# EAGLE schematic bms_master (EAGLE 6.2)
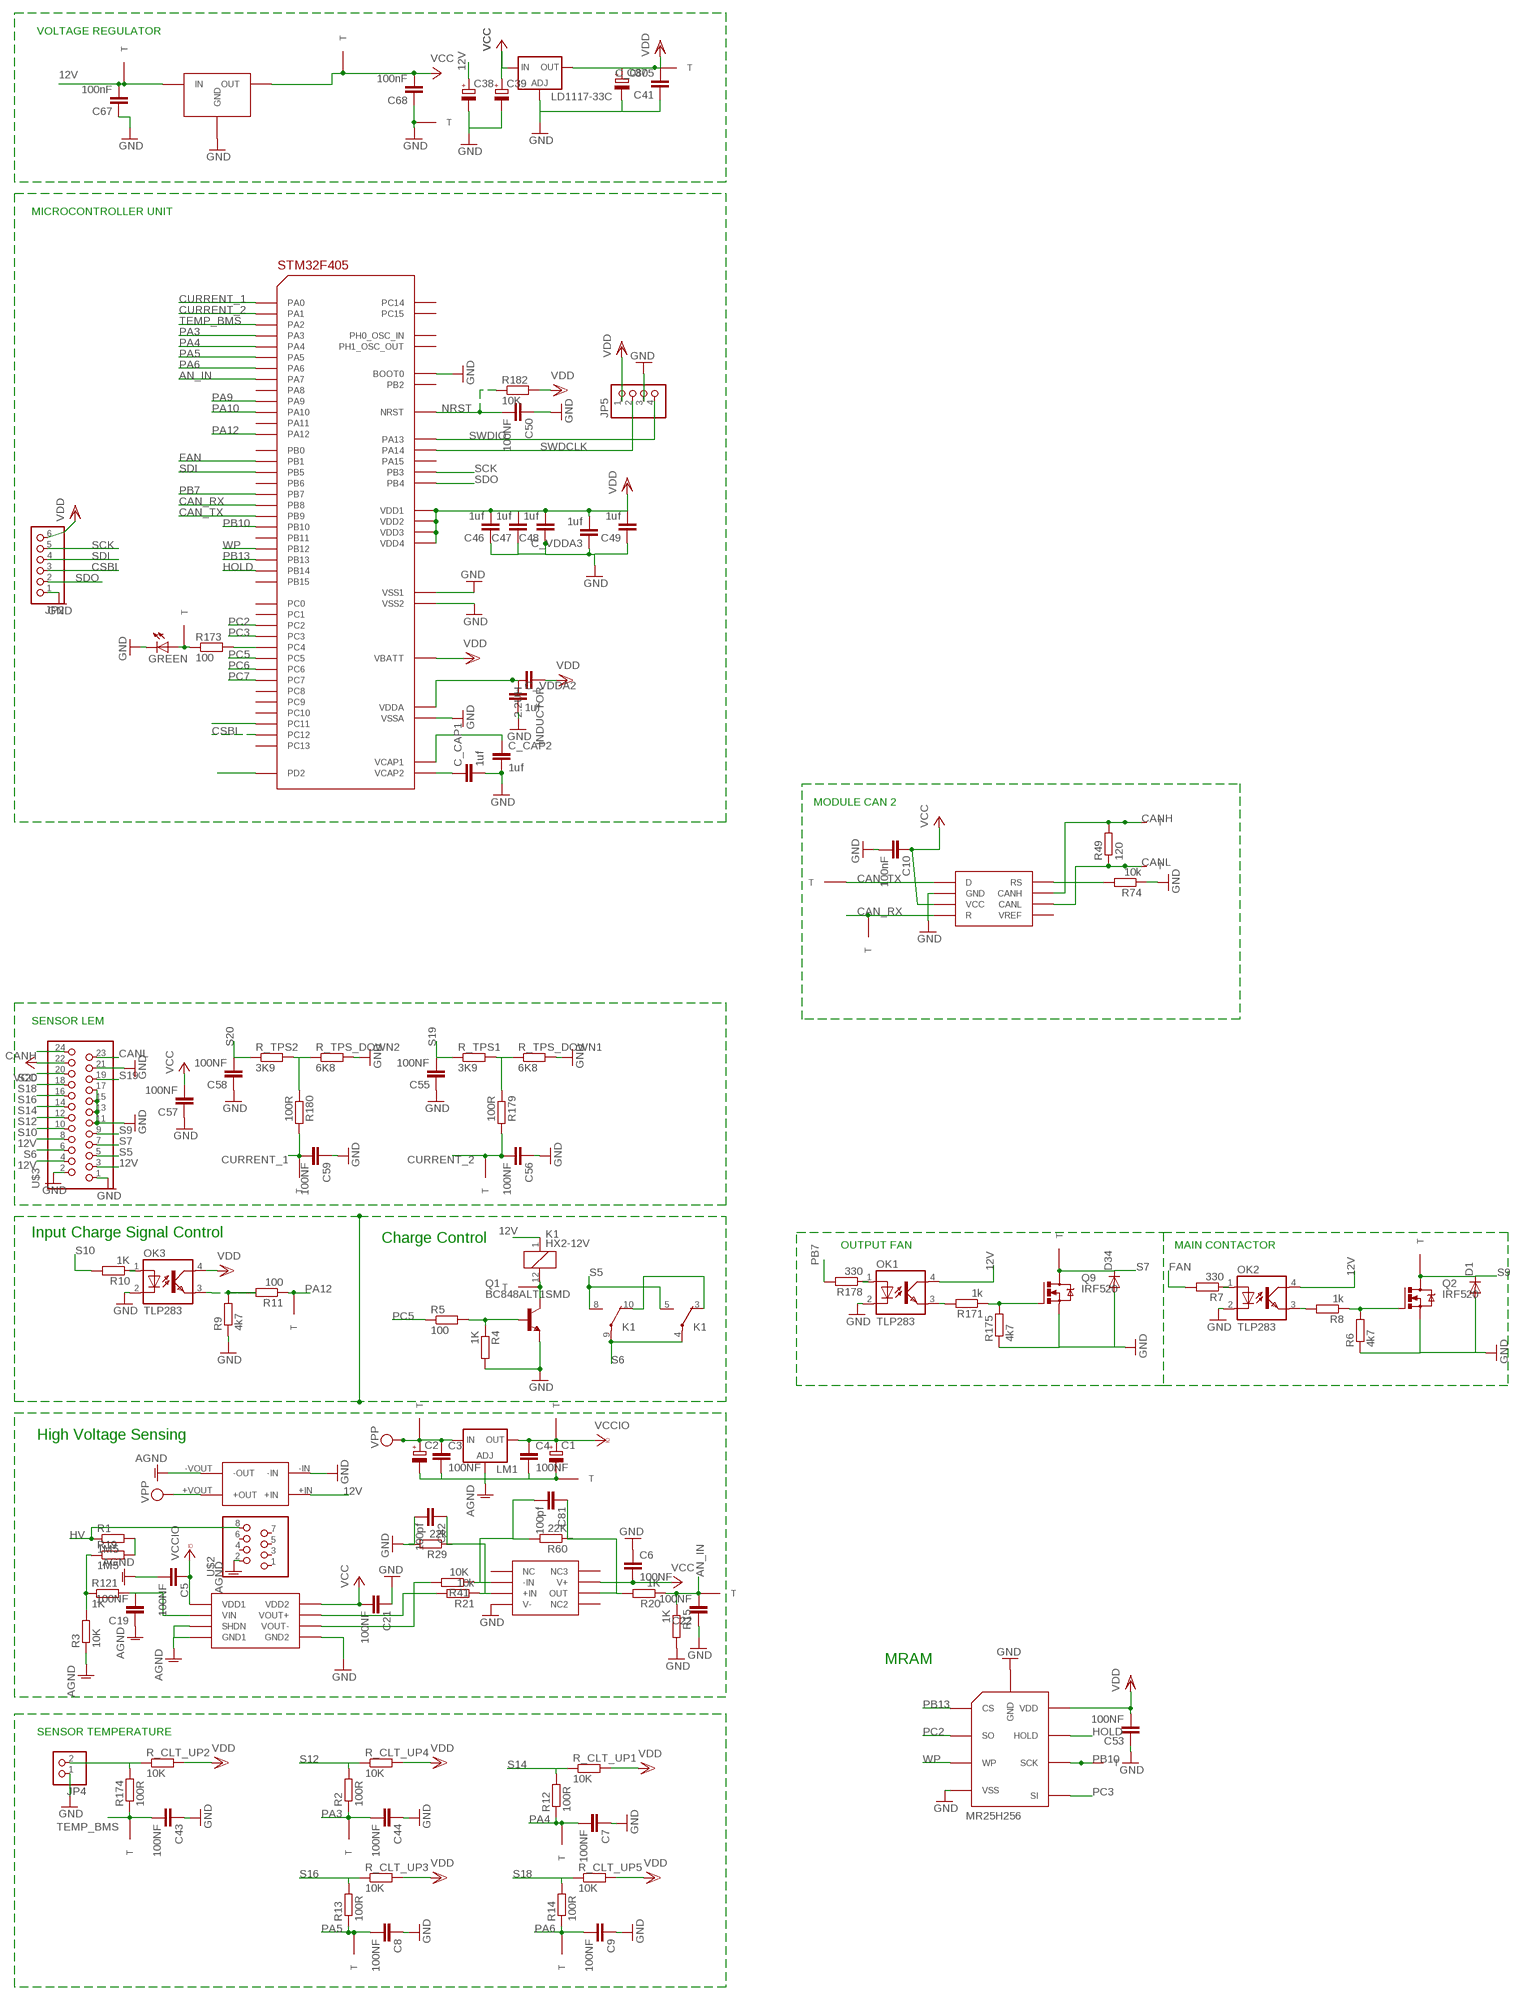
[diagram p0: schematic, sheet 1]

## Parts
C1  CPOL-EU153CLV-0605  [153CLV-0605]
C2  CPOL-EU153CLV-0810  [153CLV-0810]
C3  100NF  C_0805  [C_0805]
C4  100NF  C_0805  [C_0805]
C5  100NF  C_0805  [C_0805]
C6  100NF  C_0805  [C_0805]
C7  100NF  C_0805  [C_0805]
C8  100NF  C_0805  [C_0805]
C9  100NF  C_0805  [C_0805]
C10  100nF  C_0805  [C_0805]
C19  100NF  C_0805  [C_0805]
C21  100NF  C_0805  [C_0805]
C22  100NF  C_0805  [C_0805]
C37  CPOL-EU153CLV-0605  [153CLV-0605]
C38  CPOL-EU153CLV-0810  [153CLV-0810]
C39  CPOL-EU153CLV-0605  [153CLV-0605]
C41  C_0805  [C_0805]
C43  100NF  C_0805  [C_0805]
C44  100NF  C_0805  [C_0805]
C46  1uf  C_0805  [C_0805]
C47  1uf  C_0805  [C_0805]
C48  1uf  C_0805  [C_0805]
C49  1uf  C_0805  [C_0805]
C50  100NF  C_0805  [C_0805]
C53  100NF  C_0805  [C_0805]
C55  100NF  C_0805  [C_0805]
C56  100NF  C_0805  [C_0805]
C57  100NF  C_0805  [C_0805]
C58  100NF  C_0805  [C_0805]
C59  100NF  C_0805  [C_0805]
C67  100nF  C_0805  [C_0805]
C68  100nF  C_0805  [C_0805]
C81  100pf  C_0805  [C_0805]
C82  100pf  C_0805  [C_0805]
C_CAP1  1uf  C_0805  [C_0805]
C_CAP2  1uf  C_0805  [C_0805]
C_VDDA2  1uf  C_0805  [C_0805]
C_VDDA3  1uf  C_0805  [C_0805]
D1  DIODE-SOD80C  [SOD80C]
D34  DIODE-SOD80C  [SOD80C]
GREEN  LED3MM  [LED3MM]
INDUCTOR  2.2UH  C-EUC0805K  [C0805K]
JP2  PINHD-1X6  [1X06]
JP4  PINHD-1X2/90  [1X02/90]
JP5  PINHD-1X4  [1X04]
K1  HX2-12V  [HX]
LD1117-33C  LM317MABDT  [DPACK@1]
LM1  LM317MABDT  [DPACK@1]
OK1  TLP283  [MINI-FLAT-4]
OK2  TLP283  [MINI-FLAT-4]
OK3  TLP283  [MINI-FLAT-4]
Q1  BC848ALT1SMD  [SOT23]
Q2  IRF520  [D-PAK_TO252AA]
Q9  IRF520  [D-PAK_TO252AA]
R1  1M5  R_1210  [R1210]
R2  100R  R_EU  [R_0805]
R3  10K  R_1210  [R1210]
R4  1K  R_EU  [R_0805]
R5  100  R_EU  [R_0805]
R6  4k7  R_EU  [R_0805]
R7  330  R_EU  [R_0805]
R8  1k  R_EU  [R_0805]
R9  4k7  R_EU  [R_0805]
R10  1K  R_EU  [R_0805]
R11  100  R_EU  [R_0805]
R12  100R  R_EU  [R_0805]
R13  100R  R_EU  [R_0805]
R14  100R  R_EU  [R_0805]
R15  1K  R_EU  [R_0805]
R19  1M5  R_1210  [R1210]
R20  1K  R_EU  [R_0805]
R21  10k  R_EU  [R_0805]
R29  22k  R_EU  [R_0805]
R41  10K  R_EU  [R_0805]
R49  120  R-EU_0207/7  [0207/7]
R60  22K  R_EU  [R_0805]
R74  10k  R_EU  [R_0805]
R121  1K  R_1210  [R_1210]
R171  1k  R_EU  [R_0805]
R173  100  R_EU  [R_0805]
R174  100R  R_EU  [R_0805]
R175  4k7  R_EU  [R_0805]
R178  330  R_EU  [R_0805]
R179  100R  R_EU  [R_0805]
R180  100R  R_EU  [R_0805]
R182  10K  R_EU  [R_0805]
R_CLT_UP1  10K  R_EU  [R_0805]
R_CLT_UP2  10K  R_EU  [R_0805]
R_CLT_UP3  10K  R_EU  [R_0805]
R_CLT_UP4  10K  R_EU  [R_0805]
R_CLT_UP5  10K  R_EU  [R_0805]
R_TPS1  3K9  R_EU  [R_0805]
R_TPS2  3K9  R_EU  [R_0805]
R_TPS_DOWN1  6K8  R_EU  [R_0805]
R_TPS_DOWN2  6K8  R_EU  [R_0805]
U8  MCP2551  SN65HVD230  [SN65HVD230]
U$1  NWD5-12  [NWD5]
U$2  SOCKET8P  [8PIN]
U$3  SOCKET24P  [24PIN]
U$4  TESTPOINT  [TESTPOINT]
U$5  TESTPOINT  [TESTPOINT]
U$6  TESTPOINT  [TESTPOINT]
U$7  TESTPOINT  [TESTPOINT]
U$8  TESTPOINT  [TESTPOINT]
U$9  ACPL-C87B  [STRETCHSO8]
U$10  TESTPOINT  [TESTPOINT]
U$11  TESTPOINT  [TESTPOINT]
U$12  TESTPOINT  [TESTPOINT]
U$13  TESTPOINT  [TESTPOINT]
U$14  TESTPOINT  [TESTPOINT]
U$15  TESTPOINT  [TESTPOINT]
U$16  TESTPOINT  [TESTPOINT]
U$17  TESTPOINT  [TESTPOINT]
U$18  TESTPOINT  [TESTPOINT]
U$19  TESTPOINT  [TESTPOINT]
U$20  TESTPOINT  [TESTPOINT]
U$21  TESTPOINT  [TESTPOINT]
U$22  TESTPOINT  [TESTPOINT]
U$23  TESTPOINT  [TESTPOINT]
U$24  TESTPOINT  [TESTPOINT]
U$25  TESTPOINT  [TESTPOINT]
U$26  TESTPOINT  [TESTPOINT]
U$27  TESTPOINT  [TESTPOINT]
U$28  TESTPOINT  [TESTPOINT]
U$29  OKI-78SR-5  [MDC_OKI]
U$31  STM32F405  [TQFP64]
U$32  MR25H256  [8DFN]
U$35  TESTPOINT  [TESTPOINT]
U$70  OPA237  [SO-08]

## Nets
12V: C38.+ C67.2 K1.1 OK1.4(COL) OK2.4(COL) U$1.+IN U$3.3 U$3.4 U$3.8 U$5.P$1(T) U$29.1(IN)
AGND: C1.- C2.- C3.2 C4.2 C5.2 C19.1 LM1.1(ADJ) R3.1 U$1.-VOUT(-OUT) U$2.2 U$9.P$3(SHDN) U$9.P$4(GND1) U$20.P$1(T)
AN_IN: C22.2 R15.1 R20.1 U$22.P$1(T) U$31.23(PA7)
CAN_RX: U8.P$4(R) U$8.P$1(T) U$31.61(PB8)
CAN_TX: U8.P$1(D) U$10.P$1(T) U$31.62(PB9)
CANH: R49.2 U8.P$7(CANH) U$3.24 U$12.P$1(T)
CANL: R49.1 U8.P$6(CANL) U$3.23 U$11.P$1(T)
CSBI: JP2.3 U$31.53(PC12)
CURRENT_1: C59.2 R180.2 U$14.P$1(T) U$31.14(PA0)
CURRENT_2: C56.2 R179.2 U$13.P$1(T) U$31.15(PA1)
FAN: R7.2 U$31.27(PB1)
GND: C6.1 C7.1 C8.1 C9.1 C10.2 C21.1 C22.1 C37.- C38.- C39.- C41.1 C43.1 C44.1 C46.1 C47.1 C48.1 C49.1 C50.1 C53.1 C55.1 C56.1 C57.1 C58.1 C59.1 C67.1 C68.1 C82.2 C_CAP1.2 C_CAP2.2 C_VDDA2.2 C_VDDA3.1 D1.A D34.A GREEN.K(C) JP2.1 JP4.1 JP5.3 LD1117-33C.1(ADJ) OK1.2(C) OK2.2(C) OK3.2(C) Q1.2(E) Q2.1(S) Q9.1(S) R4.2 R6.1 R9.1 R15.2 R29.2 R74.1 R175.1 R_TPS_DOWN1.2 R_TPS_DOWN2.2 U8.P$2(GND) U$1.-IN U$3.1 U$3.2 U$3.11 U$3.13 U$3.15 U$3.17 U$3.21 U$4.P$1(T) U$9.P$5(GND2) U$29.2(GND) U$31.12(VSSA) U$31.18(VSS1) U$31.60(BOOT0) U$31.63(VSS2) U$32.P$4(VSS) U$32.P$9(GND) U$70.4(V-)
HOLD: U$31.35(PB14) U$32.P$7(HOLD)
HV: R1.1 U$2.8
N$3: Q2.3(G) R6.2 R8.1
N$4: K1.12 Q1.3(C) U$16.P$1(T)
N$5: OK2.1(A) R7.1
N$6: C19.2 R121.2 U$9.P$2(VIN)
N$7: OK2.3(EMIT) R8.2
N$8: R21.2 U$9.P$7(VOUT+)
N$9: Q1.1(B) R4.1 R5.2
N$10: K1.3(2:O) K1.10(3:O)
N$11: C81.2 R41.1 R60.2 U$70.2(-IN)
N$13: U$31.54(PD2)
N$14: R41.2 U$9.P$6(VOUT-)
N$15: OK3.1(A) R10.1
N$16: C82.1 R21.1 R29.1 U$70.3(+IN)
N$17: OK3.3(EMIT) R9.2 R11.2
N$18: R3.2 R19.1 R121.1
N$19: U$31.52(PC11)
N$23: R74.2 U8.P$8(RS)
N$71: R1.2 R19.2
N$154: C_CAP1.1 U$31.47(VCAP2)
N$155: C_CAP2.1 U$31.31(VCAP1)
N$156: R173.2 U$31.24(PC4)
N$157: GREEN.A R173.1 U$7.P$1(T)
N$158: JP4.2 R174.2 R_CLT_UP2.1
N$163: R179.1 R_TPS1.2 R_TPS_DOWN1.1
N$165: R180.1 R_TPS2.2 R_TPS_DOWN2.1
N$169: Q9.3(G) R171.1 R175.2
N$170: OK1.1(A) R178.1
N$173: OK1.3(EMIT) R171.2
N$1065: C_VDDA2.1 INDUCTOR.2 U$31.13(VDDA)
NRST: C50.2 R182.1 U$31.7(NRST)
PA3: C44.2 R2.1 U$24.P$1(T) U$31.17(PA3)
PA4: C7.2 R12.1 U$27.P$1(T) U$31.20(PA4)
PA5: C8.2 R13.1 U$25.P$1(T) U$31.21(PA5)
PA6: C9.2 R14.1 U$26.P$1(T) U$31.22(PA6)
PA9: U$31.42(PA9)
PA10: U$31.43(PA10)
PA12: R11.1 U$15.P$1(T) U$31.45(PA12)
PB7: R178.2 U$31.59(PB7)
PB10: U$28.P$1(T) U$31.29(PB10) U$32.P$6(SCK)
PB13: U$31.34(PB13) U$32.P$1(CS)
PC2: U$31.10(PC2) U$32.P$2(SO)
PC3: U$31.11(PC3) U$32.P$5(SI)
PC5: R5.1 U$31.25(PC5)
PC6: U$31.37(PC6)
PC7: U$31.38(PC7)
S5: K1.5(2:S) K1.8(3:S) U$3.5
S6: K1.4(2:P) K1.9(3:P) U$3.6
S7: D34.C Q9.4(D) U$3.7 U$17.P$1(T)
S9: D1.C Q2.4(D) U$3.9 U$18.P$1(T)
S10: R10.2 U$3.10
S12: R2.2 R_CLT_UP4.1 U$3.12
S14: R12.2 R_CLT_UP1.1 U$3.14
S16: R13.2 R_CLT_UP3.1 U$3.16
S18: R14.2 R_CLT_UP5.1 U$3.18
S19: C55.2 R_TPS1.1 U$3.19
S20: C58.2 R_TPS2.1 U$3.20
SCK: JP2.5 U$31.55(PB3)
SDI: JP2.4 U$31.57(PB5)
SDO: JP2.2 U$31.56(PB4)
SWDCLK: JP5.2 U$31.49(PA14)
SWDIO: JP5.4 U$31.46(PA13)
TEMP_BMS: C43.2 R174.1 U$23.P$1(T) U$31.16(PA2)
VCC: C6.2 C10.1 C21.2 C39.+ C57.2 C68.2 LD1117-33C.3(IN) U8.P$3(VCC) U$3.22 U$9.P$8(VDD2) U$29.3(OUT) U$35.P$1(T) U$70.7(V+)
VCCIO: C1.+ C4.1 C5.1 LM1.4(OUT) U$9.P$1(VDD1) U$19.P$1(T)
VDD: C37.+ C41.2 C46.2 C47.2 C48.2 C49.2 C53.2 C_VDDA3.2 INDUCTOR.1 JP2.6 JP5.1 LD1117-33C.4(OUT) OK3.4(COL) R182.2 R_CLT_UP1.2 R_CLT_UP2.2 R_CLT_UP3.2 R_CLT_UP4.2 R_CLT_UP5.2 U$6.P$1(T) U$31.1(VBATT) U$31.19(VDD1) U$31.32(VDD2) U$31.48(VDD3) U$31.64(VDD4) U$32.P$8(VDD)
VPP: C2.+ C3.1 LM1.3(IN) U$1.+VOUT(+OUT) U$21.P$1(T)
WP: U$31.33(PB12) U$32.P$3(WP)
Y: C81.1 R20.2 R60.1 U$70.6(OUT)
Unconnected: U8.P$5(VREF) U$2.1 U$2.3 U$2.4 U$2.5 U$2.6 U$2.7 U$31.2(PC13) U$31.3(PC14) U$31.4(PC15) U$31.5(PH0_OSC_IN) U$31.6(PH1_OSC_OUT) U$31.8(PC0) U$31.9(PC1) U$31.26(PB0) U$31.28(PB2) U$31.30(PB11) U$31.36(PB15) U$31.39(PC8) U$31.40(PC9) U$31.41(PA8) U$31.44(PA11) U$31.50(PA15) U$31.51(PC10) U$31.58(PB6) U$70.1(NC) U$70.5(NC2) U$70.8(NC3)

## Notes on the sheet
- VOLTAGE REGULATOR
- MICROCONTROLLER UNIT
- MODULE CAN 2
- SENSOR LEM
- Input Charge Signal Control
- Charge Control
- OUTPUT FAN | MAIN CONTACTOR
- High Voltage Sensing
- MRAM
- SENSOR TEMPERATURE

## Library data of the parts
C1 C2 C37-C39 = resistor:CPOL-EU: POLARIZED CAPACITOR, European symbol
C3-C10 C19 C21 C22 C41 C43 C44 C46-C50 C53 C55-C59 C67 C68 C81 C82 C_CAP1 C_CAP2 C_VDDA2 C_VDDA3 = IVC_FF600:C_0805
D1 D34 = diode:DIODE-: DIODE
GREEN = led:LED: LED OSRAM: - CHIPLED LG R971, LG N971, LY N971, LG Q971, LY Q971, LO R971, LY R971 LH N974, LH R974 LS Q976, LO Q976, LY Q976 LO Q996 - Hyper CHIPLED LW Q18S LB Q993, LB Q99A, LB R99A - SideLED LS A670, LO A670, LY A670, LG A670, LP A670 LB A673, LV A673, LT A673, LW A673 LH A674 LY A675 LS A676, LA A676, LO A676, LY A676, LW A676 LS A679, LY A679, LG A679 - Hyper Micro SIDELED® LS Y876, LA Y876, LO Y876, LY Y876 LT Y87S - SmartLED LW L88C, LW L88S LB L89C, LB L89S, LG L890 LS L89K, LO L89K, LY L89K LS L896, LA L896, LO L896, LY L896 - TOPLED LS T670, LO T670, LY T670, LG T670, LP T670 LSG T670, LSP T670, LSY T670, LOP T670, LYG T670 LG T671, LOG T671, LSG T671 LB T673, LV T673, LT T673, LW T673 LH T674 LS T676, LA T676, LO T676, LY T676, LB T676, LH T676, LSB T676, LW T676 LB T67C, LV T67C, LT T67C, LS T67K, LO T67K, LY T67K, LW E67C LS E67B, LA E67B, LO E67B, LY E67B, LB E67C, LV E67C, LT E67C LW T67C LS T679, LY T679, LG T679 LS T770, LO T770, LY T770, LG T770, LP T770 LB T773, LV T773, LT T773, LW T773 LH T774 LS E675, LA E675, LY E675, LS T675 LS T776, LA T776, LO T776, LY T776, LB T776 LHGB T686 LT T68C, LB T68C - Hyper Mini TOPLED® LB M676 - Mini TOPLED Santana® LG M470 LS M47K, LO M47K, LY M47K Source: http://www.osram.convergy.de LUXEON: - LUMILED® LXK2-PW12-R00, LXK2-PW12-S00, LXK2-PW14-U00, LXK2-PW14-V00 LXK2-PM12-R00, LXK2-PM12-S00, LXK2-PM14-U00 LXK2-PE12-Q00, LXK2-PE12-R00, LXK2-PE12-S00, LXK2-PE14-T00, LXK2-PE14-U00 LXK2-PB12-K00, LXK2-PB12-L00, LXK2-PB12-M00, LXK2-PB14-N00, LXK2-PB14-P00, LXK2-PB14-Q00 LXK2-PR12-L00, LXK2-PR12-M00, LXK2-PR14-Q00, LXK2-PR14-R00 LXK2-PD12-Q00, LXK2-PD12-R00, LXK2-PD12-S00 LXK2-PH12-R00, LXK2-PH12-S00 LXK2-PL12-P00, LXK2-PL12-Q00, LXK2-PL12-R00 Source: www.luxeon.com KINGBRIGHT: KA-3528ASYC Source: www.kingbright.com
INDUCTOR = resistor:C-EU: CAPACITOR, European symbol
JP2 = pinhead:PINHD-1X6: PIN HEADER
JP4 = pinhead:PINHD-1X2: PIN HEADER
JP5 = pinhead:PINHD-1X4: PIN HEADER
K1 = relay:HX2-*: Compact & Slim 2 Form C Non-polarized Relay NAiS Source: http://www.mew-europe.com/.. en_ds_61011_0000.pdf; OC_FARNELL: unknown; OC_NEWARK: unknown
LD1117-33C LM1 = v-reg:LM317?*: 500 mA Adjustable Output Positive Voltage Regulator Source: http://www.onsemi.co.jp .. LM317M-D.PDF
OK1-OK3 = optocoupler:TLP283: TOSHIBA PHOTOCOUPLER GaAs IRED & PHOTO-TRANSISTOR Source: http://www.semicon.toshiba.co.jp/td/en/Opto/Photocoupler/en_20050928_TLP283_datasheet.pdf; OC_FARNELL: unknown; OC_NEWARK: unknown
Q1 = transistor-npn:BC848*: NPN Transistor
Q2 Q9 = transistor-power:IRF520: HEXFET Power MOSFET
R1 R3 R19 = Controller_All:R_1210
R2 R4-R15 R20 R21 R29 R41 R60 R74 R171 R173-R175 R178-R180 R182 R_CLT_UP1-R_CLT_UP5 R_TPS1 R_TPS2 R_TPS_DOWN1 R_TPS_DOWN2 = IVC_FF600:R_EU
R49 = resistor:R-EU_: RESISTOR, European symbol
R121 = IVC:R_1210
U8 = sn65hvd230:SN65HVD230
U$1 = jsygpower:NWD5-12
U$2 = bms_gesits:SOCKET8P
U$3 = bms_gesits:SOCKET24P
U$4-U$8 U$10-U$28 U$35 = testpoint:TESTPOINT
U$9 = AVAGO_NEW:ACPL-C87B
U$29 = Controller_All:OKI-78SR-5
U$31 = bms_gesits:STM32F405
U$32 = bms_gesits:MR25H256
U$70 = texas:OPA237